# EAGLE schematic clvHdMaster (EAGLE 9.6.2)
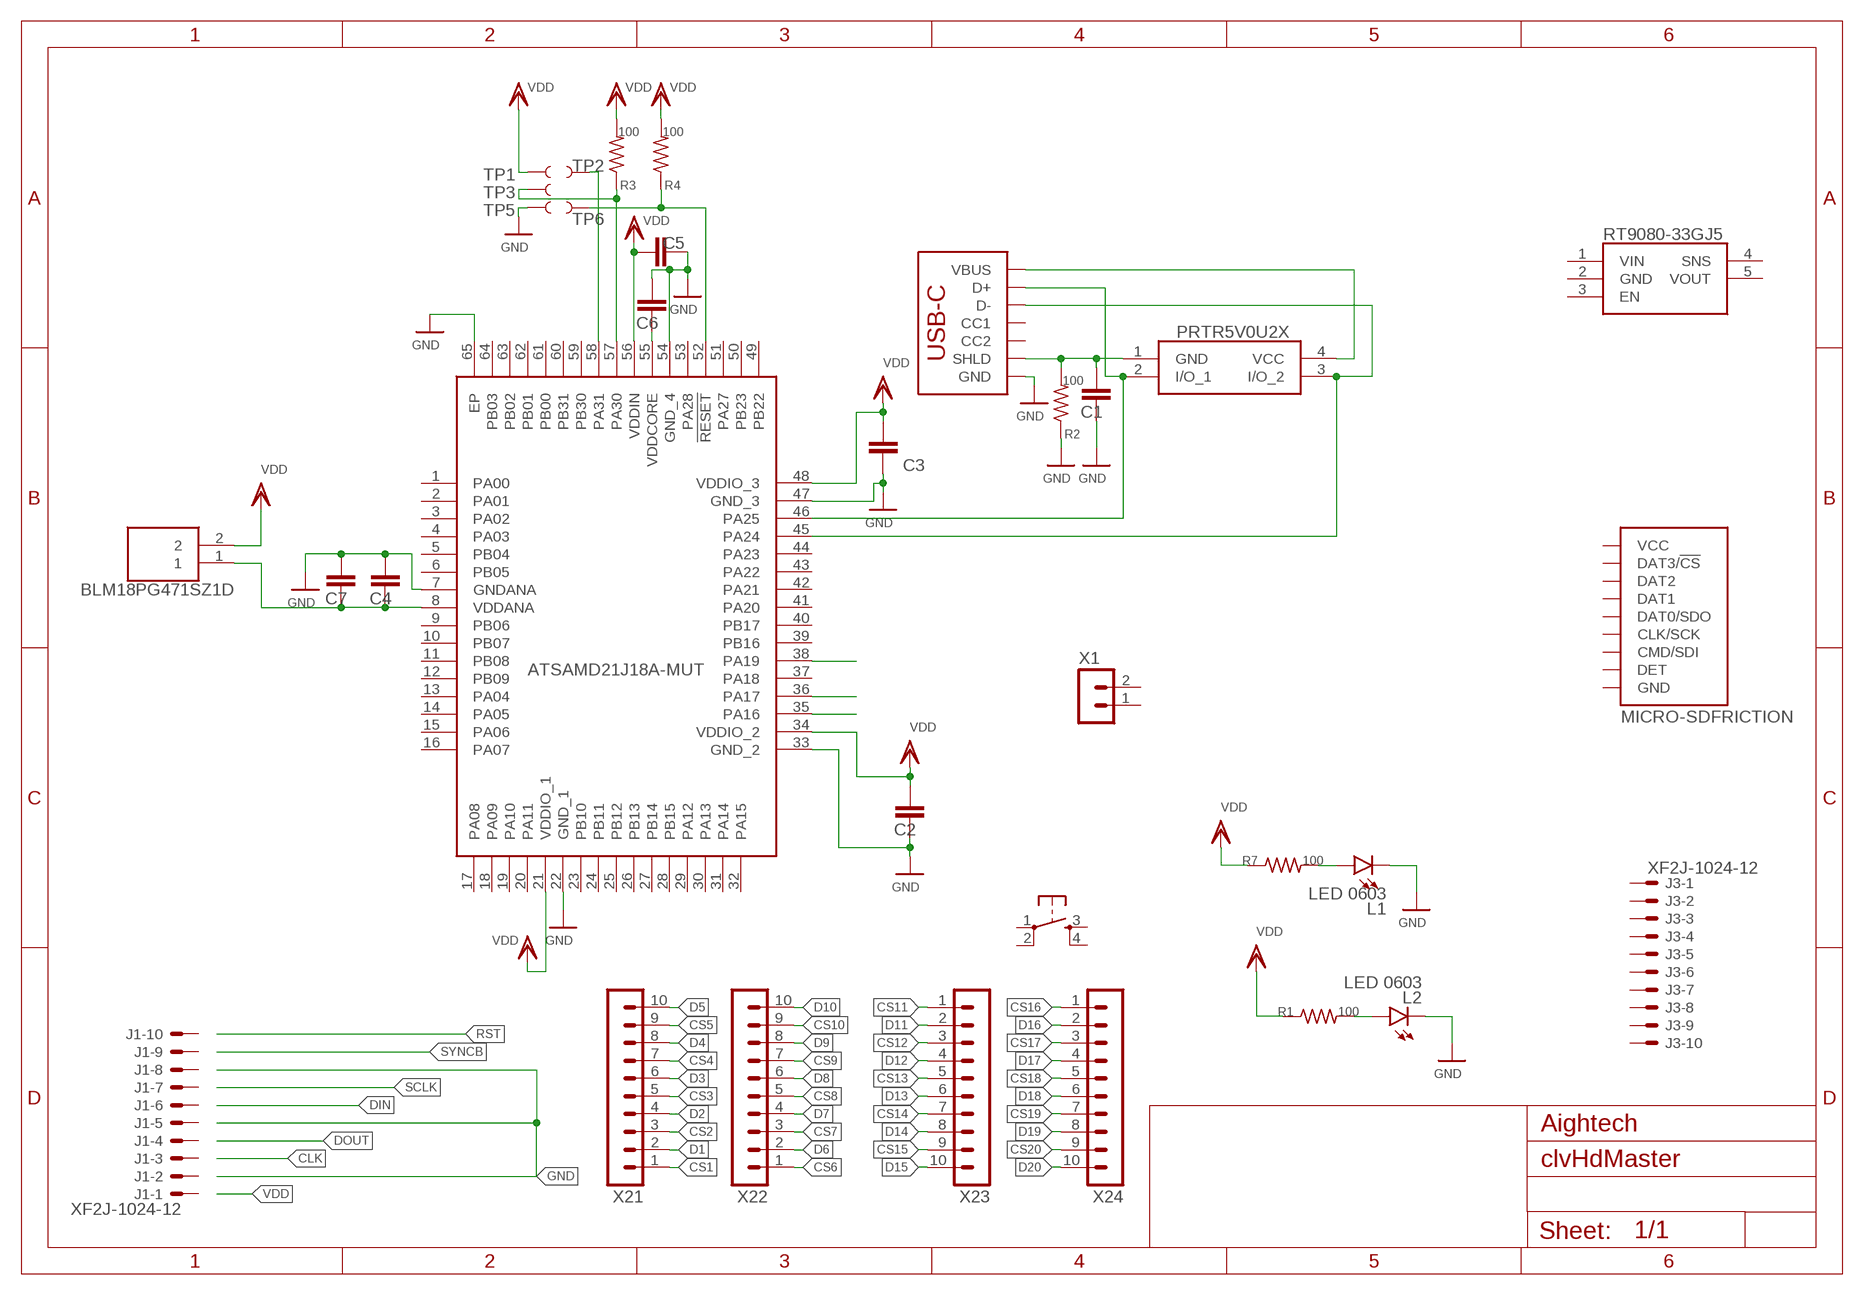
[diagram p0: schematic, sheet 1]

## Parts
C1  C-EUC0402  [C0402]
C2  C-EUC0402  [C0402]
C3  C-EUC0402  [C0402]
C4  C-EUC0402  [C0402]
C5  C-EUC0402  [C0402]
C6  C-EUC0402  [C0402]
C7  C-EUC0402  [C0402]
D1  PRTR5V0U2X  [PRTR5V0U2X]
FL1  BLM18PG471SZ1D  [BLM18AG102BH1D]
IC1  ATSAMD21J18A-MUT  [QFN50P900X900X100-65N]
IC2  RT9080-33GJ5  [SOT94P280X100-5N]
J1  XF2J-1024-12  [XF2J-1024-12]
J2  USB_C_2-LAYER_PADS  [USB-C-16P-2LAYER-PADS]
J3  XF2J-1024-12  [XF2J-1024-12]
J4  MICRO-SDFRICTION  [MICROSD_TINY]
L1  LED 0603  LEDCHIP-LED0603  [CHIP-LED0603]
L2  LED 0603  LEDCHIP-LED0603  [CHIP-LED0603]
R1  100  R-US_R0402  [R0402]
R2  100  R-US_R0402  [R0402]
R3  100  R-US_R0402  [R0402]
R4  100  R-US_R0402  [R0402]
R7  100  R-US_R0402  [R0402]
S2  TAC_SWITCHSMD  [TACTILE-SWITCH-SMD]
TP1  TEST-POINT3  [PAD.03X.03]
TP2  TEST-POINT3  [PAD.03X.03]
TP3  TEST-POINT3  [PAD.03X.03]
TP5  TEST-POINT3  [PAD.03X.03]
TP6  TEST-POINT3  [PAD.03X.03]
X1  BM02B-SRSS-TB  [BM02B-SRSS-TB]
X21  BM10B-SRSS-TB  [BM10B-SRSS-TB]
X22  BM10B-SRSS-TB  [BM10B-SRSS-TB]
X23  BM10B-SRSS-TB  [BM10B-SRSS-TB]
X24  BM10B-SRSS-TB  [BM10B-SRSS-TB]

## Nets
CS1: X21.1
CS2: X21.3
CS3: X21.5
CS4: X21.7
CS5: X21.9
CS6: X22.1
CS7: X22.3
CS8: X22.5
CS9: X22.7
CS10: X22.9
CS11: X23.1
CS12: X23.3
CS13: X23.5
CS14: X23.7
CS15: X23.9
CS16: X24.1
CS17: X24.3
CS18: X24.5
CS19: X24.7
CS20: X24.9
D1: X21.2
D2: X21.4
D3: X21.6
D4: X21.8
D5: X21.10
D6: X22.2
D7: X22.4
D8: X22.6
D9: X22.8
D10: X22.10
D11: X23.2
D12: X23.4
D13: X23.6
D14: X23.8
D15: X23.10
D16: X24.2
D17: X24.4
D18: X24.6
D19: X24.8
D20: X24.10
GND: C1.2 C2.2 C3.2 C4.1 C5.1 C6.1 C7.1 IC1.7(GNDANA) IC1.22(GND_1) IC1.33(GND_2) IC1.47(GND_3) IC1.54(GND_4) IC1.65(EP) J2.GND J2.GND2(GND) L1.C L2.C R2.1 TP5.1
N$1: L2.A R1.2
N$2: L1.A R7.2
N$3: C1.1 D1.1(GND) J2.SHLD1(SHLD) J2.SHLD2(SHLD) J2.SHLD3(SHLD) J2.SHLD4(SHLD) R2.2
N$4: D1.4(VCC) J2.VBUS1(VBUS) J2.VBUS2(VBUS)
N$5: D1.2(I/O_1) IC1.46(PA25) J2.A6(D+) J2.B6(D+)
N$6: D1.3(I/O_2) IC1.45(PA24) J2.A7(D-) J2.B7(D-)
N$7: IC1.35(PA16)
N$8: C6.2 IC1.55(VDDCORE)
N$9: C4.2 C7.2 FL1.1 IC1.8(VDDANA)
N$10: IC1.36(PA17)
N$11: IC1.38(PA19)
N$12: IC1.52(!RESET) R4.1 TP6.1
N$13: IC1.58(PA31) TP2.1
N$15: IC1.57(PA30) R3.1 TP3.1
VDD: C2.1 C3.1 C5.2 FL1.2 IC1.21(VDDIO_1) IC1.34(VDDIO_2) IC1.48(VDDIO_3) IC1.56(VDDIN) R1.1 R3.2 R4.2 R7.1 TP1.1
Unconnected: IC1.1(PA00) IC1.2(PA01) IC1.3(PA02) IC1.4(PA03) IC1.5(PB04) IC1.6(PB05) IC1.9(PB06) IC1.10(PB07) IC1.11(PB08) IC1.12(PB09) IC1.13(PA04) IC1.14(PA05) IC1.15(PA06) IC1.16(PA07) IC1.17(PA08) IC1.18(PA09) IC1.19(PA10) IC1.20(PA11) IC1.23(PB10) IC1.24(PB11) IC1.25(PB12) IC1.26(PB13) IC1.27(PB14) IC1.28(PB15) IC1.29(PA12) IC1.30(PA13) IC1.31(PA14) IC1.32(PA15) IC1.37(PA18) IC1.39(PB16) IC1.40(PB17) IC1.41(PA20) IC1.42(PA21) IC1.43(PA22) IC1.44(PA23) IC1.49(PB22) IC1.50(PB23) IC1.51(PA27) IC1.53(PA28) IC1.59(PB30) IC1.60(PB31) IC1.61(PB00) IC1.62(PB01) IC1.63(PB02) IC1.64(PB03) IC2.1(VIN) IC2.2(GND) IC2.3(EN) IC2.4(SNS) IC2.5(VOUT) J1.1 J1.2 J1.3 J1.4 J1.5 J1.6 J1.7 J1.8 J1.9 J1.10 J2.A5(CC1) J2.B5(CC2) J3.1 J3.2 J3.3 J3.4 J3.5 J3.6 J3.7 J3.8 J3.9 J3.10 J4.1(DAT2) J4.2(DAT3/!CS!) J4.3(CMD/SDI) J4.4(VCC) J4.5(CLK/SCK) J4.6(GND) J4.7(DAT0/SDO) J4.8(DAT1) J4.9(DET) J4.GND1(GND) J4.GND2(GND) J4.GND3(GND) J4.GND4(GND) J4.GND5(GND) J4.GND6(GND) S2.1 S2.2 S2.3 S2.4 X1.1 X1.2

## Notes on the sheet
- Aightech

## Library data of the parts
C1-C7 = rclCustom:C-EU: CAPACITOR, European symbol; SPICEPREFIX: C
D1 = SamacSys_Parts:PRTR5V0U2X: NEXPERIA - PRTR5V0U2X - DIODE, TVS, DUAL, SOT-143B Source: Datasheet <https://assets.nexperia.com/documents/data-sheet/PRTR5V0U2X.pdf>; DESCRIPTION: NEXPERIA - PRTR5V0U2X - DIODE, TVS, DUAL, SOT-143B; HEIGHT: 1.1mm; MANUFACTURER_NAME: Nexperia; MANUFACTURER_PART_NUMBER: PRTR5V0U2X
FL1 = SamacSys_Parts:BLM18PG471SZ1D: BLM18_Z1D Series EMI Suppression Filter 470+/-25% at 100MHz 1A @85 Source: Datasheet <https://www.murata.com/en-us/products/productdetail?partno=BLM18PG471SZ1#>; DESCRIPTION: BLM18_Z1D Series EMI Suppression Filter 470+/-25% at 100MHz 1A @85; HEIGHT: 0.95mm; MANUFACTURER_NAME: Murata Electronics; MANUFACTURER_PART_NUMBER: BLM18PG471SZ1D
IC1 = SamacSys_Parts:ATSAMD21J18A-MUT: ARM Microcontrollers - MCU 256KB 32KB 64QFN GRN1.6-3.6V48MHz Source: Datasheet <https://datasheet.datasheetarchive.com/originals/distributors/DKDS41/DSANUWW0026743.pdf>; DESCRIPTION: ARM Microcontrollers - MCU 256KB 32KB 64QFN GRN1.6-3.6V48MHz; HEIGHT: 1mm; MANUFACTURER_NAME: Microchip; MANUFACTURER_PART_NUMBER: ATSAMD21J18A-MUT
IC2 = SamacSys_Parts:RT9080-33GJ5: IC REG LIN 3.3V 600MA TSOT23-5 Source: Datasheet <https://www.richtek.com/assets/product_file/RT9080/DS9080-05.pdf>; DESCRIPTION: IC REG LIN 3.3V 600MA TSOT23-5; HEIGHT: 1mm; MANUFACTURER_NAME: RICHTEK; MANUFACTURER_PART_NUMBER: RT9080-33GJ5
J1 J3 = con-omron:XF2*-10?: OMRON FPC Connector Source : http://www.omron.com/ecb/products/pdf/fpc.pdf; OC_FARNELL: unknown; OC_NEWARK: unknown
J2 = SparkFun-Connectors:USB_C: USB Type C 16Pin Connector Super Speed pins not available on the 16-pin purely SMD connector so this part is best for USB 2.0 implementations. D1 and D2 are tied together enabling D+/- no matter which way the cable is plugged into the connector. The two channel configuration pins (CC1/2) are exposed. These are normally connected to ground via 5.1k resistors but can be reconfigured for high current/high power applications. **4-LAYER BOARD WARNING!!** If designing 4-layer board, make sure to select the variant _4-LAYER-ISOLATED. The linked footprint (USB-C-16-4LAYER-ISOLATED) includes some very necessary cutout polygons in the inner layers (2 and 15). This prevents the PTH mounting shield legs on the USB connector from electrically connecting any other polygons on the inner layers (usually VCC and GND).; PROD_ID: CONN-14122
J4 = SparkFun-Connectors:MICRO-SD: microSD Socket for Transflash Various sockets for µSD. tDoc lines correctly indicate media card edge positions when inserting (unlocked, locked, depressed). NOTE: CD1 and CD2 are connected internally, and the default detect state of the socket is detect pin to ground. SparkFun Products: WAV Trigger <https://www.sparkfun.com/products/13660> CAN-Bus Shield <https://www.sparkfun.com/products/13262> SparkFun Level Shifing microSD Breakout <https://www.sparkfun.com/products/13743>; PROD_ID: CONN-13500
L1 L2 = led:LED: LED OSRAM: - CHIPLED LG R971, LG N971, LY N971, LG Q971, LY Q971, LO R971, LY R971 LH N974, LH R974 LS Q976, LO Q976, LY Q976 LO Q996 - Hyper CHIPLED LW Q18S LB Q993, LB Q99A, LB R99A - SideLED LS A670, LO A670, LY A670, LG A670, LP A670 LB A673, LV A673, LT A673, LW A673 LH A674 LY A675 LS A676, LA A676, LO A676, LY A676, LW A676 LS A679, LY A679, LG A679 - Hyper Micro SIDELED® LS Y876, LA Y876, LO Y876, LY Y876 LT Y87S - SmartLED LW L88C, LW L88S LB L89C, LB L89S, LG L890 LS L89K, LO L89K, LY L89K LS L896, LA L896, LO L896, LY L896 - TOPLED LS T670, LO T670, LY T670, LG T670, LP T670 LSG T670, LSP T670, LSY T670, LOP T670, LYG T670 LG T671, LOG T671, LSG T671 LB T673, LV T673, LT T673, LW T673 LH T674 LS T676, LA T676, LO T676, LY T676, LB T676, LH T676, LSB T676, LW T676 LB T67C, LV T67C, LT T67C, LS T67K, LO T67K, LY T67K, LW E67C LS E67B, LA E67B, LO E67B, LY E67B, LB E67C, LV E67C, LT E67C LW T67C LS T679, LY T679, LG T679 LS T770, LO T770, LY T770, LG T770, LP T770 LB T773, LV T773, LT T773, LW T773 LH T774 LS E675, LA E675, LY E675, LS T675 LS T776, LA T776, LO T776, LY T776, LB T776 LHGB T686 LT T68C, LB T68C - Hyper Mini TOPLED® LB M676 - Mini TOPLED Santana® LG M470 LS M47K, LO M47K, LY M47K Source: http://www.osram.convergy.de LUXEON: - LUMILED® LXK2-PW12-R00, LXK2-PW12-S00, LXK2-PW14-U00, LXK2-PW14-V00 LXK2-PM12-R00, LXK2-PM12-S00, LXK2-PM14-U00 LXK2-PE12-Q00, LXK2-PE12-R00, LXK2-PE12-S00, LXK2-PE14-T00, LXK2-PE14-U00 LXK2-PB12-K00, LXK2-PB12-L00, LXK2-PB12-M00, LXK2-PB14-N00, LXK2-PB14-P00, LXK2-PB14-Q00 LXK2-PR12-L00, LXK2-PR12-M00, LXK2-PR14-Q00, LXK2-PR14-R00 LXK2-PD12-Q00, LXK2-PD12-R00, LXK2-PD12-S00 LXK2-PH12-R00, LXK2-PH12-S00 LXK2-PL12-P00, LXK2-PL12-Q00, LXK2-PL12-R00 Source: www.luxeon.com KINGBRIGHT: KA-3528ASYC Source: www.kingbright.com
R1-R4 R7 = rcl:R-US_: RESISTOR, American symbol; SPICEPREFIX: R
S2 = SparkFun-Retired:TAC_SWITCH: Momentary Switch Button commonly used for reset or general input. Spark Fun Electronics SKU : COM-00097 SMT- SWCH-08247; PROD_ID: SWCH-08247
TP1-TP3 TP5 TP6 = SparkFun-Connectors:TEST-POINT: SparkFun Test Points Bare copper test points for troubleshooting or In-Circuit-Testing. These are used by our Production team for verifying production board runs using pogo-pins on test beds. SparkFun Products: SparkFun LSM9DS1 Breakout <https://www.sparkfun.com/products/13284> SparkFun PSOC <https://www.sparkfun.com/products/13714> SparkFun Load Cell Amplifier <https://www.sparkfun.com/products/13879>
X1 = con-JST SH:BM02B-SRSS: JST SH series header 1.00mm pitch disconnectable crimp style connectors, vertical (side entry type), 2 pins
X21-X24 = con-JST SH:BM10B-SRSS: JST SH series header 1.00mm pitch disconnectable crimp style connectors, vertical (side entry type), 10 pins